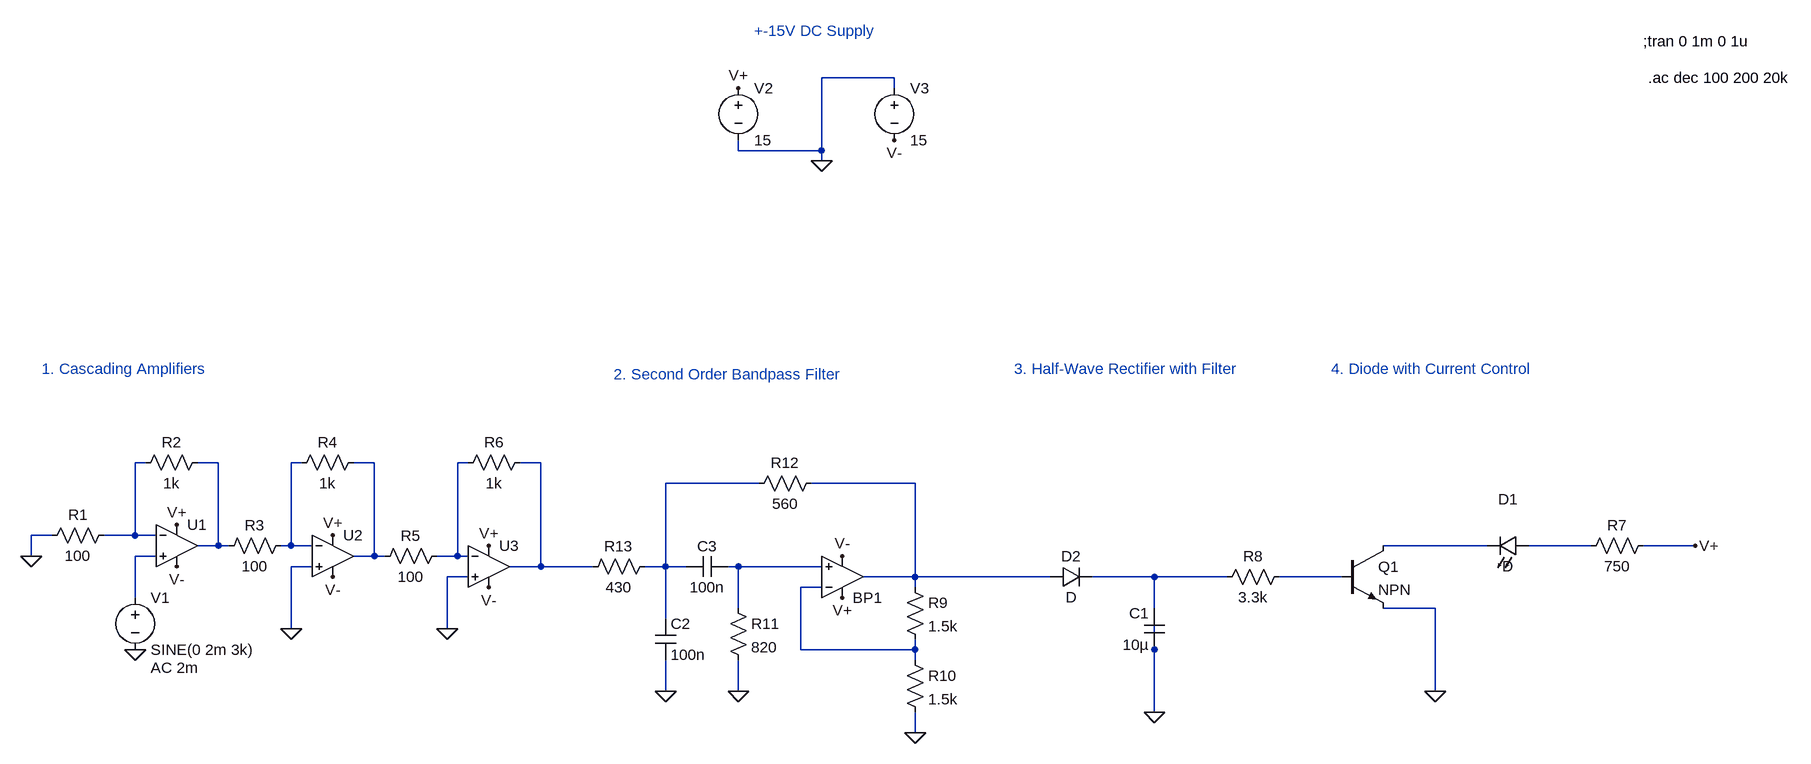
[diagram p0: schematic BP_TEST.asc]
BP_TEST.asc, the LTspice schematic file:
Version 4
SHEET 1 2900 680
WIRE 1056 -560 944 -560
WIRE 1056 -544 1056 -560
WIRE 816 -448 816 -464
WIRE 944 -448 944 -560
WIRE 944 -448 816 -448
WIRE 944 -432 944 -448
WIRE -96 32 -112 32
WIRE 16 32 -16 32
WIRE 144 32 128 32
WIRE 256 32 224 32
WIRE 400 32 384 32
WIRE 512 32 480 32
WIRE 848 64 704 64
WIRE 1088 64 928 64
WIRE -240 144 -272 144
WIRE -112 144 -112 32
WIRE -112 144 -160 144
WIRE -80 144 -112 144
WIRE 16 160 16 32
WIRE 16 160 -16 160
WIRE 32 160 16 160
WIRE 128 160 128 32
WIRE 128 160 112 160
WIRE 160 160 128 160
WIRE 1968 160 1808 160
WIRE 2128 160 2032 160
WIRE 2288 160 2208 160
WIRE -272 176 -272 144
WIRE -80 176 -112 176
WIRE 256 176 256 32
WIRE 256 176 224 176
WIRE 272 176 256 176
WIRE 384 176 384 32
WIRE 384 176 352 176
WIRE 400 176 384 176
WIRE 160 192 128 192
WIRE 512 192 512 32
WIRE 512 192 464 192
WIRE 592 192 512 192
WIRE 704 192 704 64
WIRE 704 192 672 192
WIRE 736 192 704 192
WIRE 816 192 800 192
WIRE 944 192 816 192
WIRE 400 208 368 208
WIRE 1088 208 1088 64
WIRE 1088 208 1008 208
WIRE 1296 208 1088 208
WIRE 1456 208 1360 208
WIRE 1568 208 1456 208
WIRE 1744 208 1648 208
WIRE 944 224 912 224
WIRE 1088 224 1088 208
WIRE -112 240 -112 176
WIRE 816 256 816 192
WIRE 1456 256 1456 208
WIRE 1888 256 1808 256
WIRE 704 272 704 192
WIRE 128 288 128 192
WIRE 368 288 368 208
WIRE 912 320 912 224
WIRE 1088 320 1088 304
WIRE 1088 320 912 320
WIRE 1456 320 1456 272
WIRE 1088 336 1088 320
WIRE 704 384 704 336
WIRE 816 384 816 336
WIRE 1888 384 1888 256
WIRE 1456 416 1456 320
WIRE 1088 448 1088 416
FLAG 432 160 V+
FLAG 192 144 V+
FLAG -48 128 V+
FLAG 432 224 V-
FLAG 192 208 V-
FLAG -48 192 V-
FLAG -272 176 0
FLAG 128 288 0
FLAG 368 288 0
FLAG -112 320 0
FLAG 1888 384 0
FLAG 1456 416 0
FLAG 2288 160 V+
FLAG 944 -432 0
FLAG 816 -544 V+
FLAG 1056 -464 V-
FLAG 976 240 V+
FLAG 976 176 V-
FLAG 1088 448 0
FLAG 816 384 0
FLAG 704 384 0
SYMBOL OpAmps\\UniversalOpAmp -48 160 R0
SYMATTR InstName U1
SYMBOL OpAmps\\UniversalOpAmp 192 176 R0
SYMATTR InstName U2
SYMBOL OpAmps\\UniversalOpAmp 432 192 R0
SYMATTR InstName U3
SYMBOL res -144 128 R90
WINDOW 0 0 56 VBottom 2
WINDOW 3 32 56 VTop 2
SYMATTR InstName R1
SYMATTR Value 100
SYMBOL res 0 16 R90
WINDOW 0 0 56 VBottom 2
WINDOW 3 32 56 VTop 2
SYMATTR InstName R2
SYMATTR Value 1k
SYMBOL res 128 144 R90
WINDOW 0 0 56 VBottom 2
WINDOW 3 32 56 VTop 2
SYMATTR InstName R3
SYMATTR Value 100
SYMBOL res 240 16 R90
WINDOW 0 0 56 VBottom 2
WINDOW 3 32 56 VTop 2
SYMATTR InstName R4
SYMATTR Value 1k
SYMBOL res 368 160 R90
WINDOW 0 0 56 VBottom 2
WINDOW 3 32 56 VTop 2
SYMATTR InstName R5
SYMATTR Value 100
SYMBOL res 496 16 R90
WINDOW 0 0 56 VBottom 2
WINDOW 3 32 56 VTop 2
SYMATTR InstName R6
SYMATTR Value 1k
SYMBOL voltage -112 224 R0
WINDOW 123 24 124 Left 2
WINDOW 39 0 0 Left 0
SYMATTR Value2 AC 2m
SYMATTR InstName V1
SYMATTR Value SINE(0 2m 3k)
SYMBOL npn 1744 160 R0
SYMATTR InstName Q1
SYMBOL LED 2032 176 M270
WINDOW 0 72 32 VTop 2
WINDOW 3 0 32 VBottom 2
SYMATTR InstName D1
SYMBOL res 2224 144 R90
WINDOW 0 0 56 VBottom 2
WINDOW 3 32 56 VTop 2
SYMATTR InstName R7
SYMATTR Value 750
SYMBOL diode 1296 224 R270
WINDOW 0 32 32 VTop 2
WINDOW 3 0 32 VBottom 2
SYMATTR InstName D2
SYMBOL cap 1472 320 R180
WINDOW 0 24 56 Left 2
WINDOW 3 24 8 Left 2
SYMATTR InstName C1
SYMATTR Value 10µ
SYMBOL res 1664 192 R90
WINDOW 0 0 56 VBottom 2
WINDOW 3 32 56 VTop 2
SYMATTR InstName R8
SYMATTR Value 3.3k
SYMBOL voltage 816 -560 R0
SYMATTR InstName V2
SYMATTR Value 15
SYMBOL voltage 1056 -560 R0
SYMATTR InstName V3
SYMATTR Value 15
SYMBOL OpAmps\\UniversalOpAmp 976 208 M180
SYMATTR InstName BP1
SYMBOL res 1072 208 R0
SYMATTR InstName R9
SYMATTR Value 1.5k
SYMBOL res 1072 320 R0
SYMATTR InstName R10
SYMATTR Value 1.5k
SYMBOL res 800 240 R0
SYMATTR InstName R11
SYMATTR Value 820
SYMBOL res 944 48 R90
WINDOW 0 0 56 VBottom 2
WINDOW 3 32 56 VTop 2
SYMATTR InstName R12
SYMATTR Value 560
SYMBOL res 688 176 R90
WINDOW 0 0 56 VBottom 2
WINDOW 3 32 56 VTop 2
SYMATTR InstName R13
SYMATTR Value 430
SYMBOL cap 688 272 R0
SYMATTR InstName C2
SYMATTR Value 100n
SYMBOL cap 800 176 R90
WINDOW 0 0 32 VBottom 2
WINDOW 3 32 32 VTop 2
SYMATTR InstName C3
SYMATTR Value 100n
TEXT -256 -112 Left 2 ;1. Cascading Amplifiers
TEXT 1240 -112 Left 2 ;3. Half-Wave Rectifier with Filter
TEXT 1728 -112 Left 2 ;4. Diode with Current Control
TEXT 2208 -616 Left 2 !;tran 0 1m 0 1u
TEXT 840 -632 Left 2 ;+-15V DC Supply
TEXT 2216 -560 Left 2 !.ac dec 100 200 20k
TEXT 624 -104 Left 2 ;2. Second Order Bandpass Filter

The netlist it stands for:
* BP_TEST.asc
XU1 N011 N001 V+ V- N002 level1 Avol=1Meg GBW=10Meg Vos=0 En=0 Enk=0 In=0 Ink=0 Rin=500Meg  ; pins In+ In- V+ V- OUT
XU2 0 N003 V+ V- N004 level1 Avol=1Meg GBW=10Meg Vos=0 En=0 Enk=0 In=0 Ink=0 Rin=500Meg  ; pins In+ In- V+ V- OUT
XU3 0 N005 V+ V- N006 level1 Avol=1Meg GBW=10Meg Vos=0 En=0 Enk=0 In=0 Ink=0 Rin=500Meg  ; pins In+ In- V+ V- OUT
R1 N001 0 100
R2 N002 N001 1k
R3 N003 N002 100
R4 N004 N003 1k
R5 N005 N004 100
R6 N006 N005 1k
V1 N011 0 SINE(0 2m 3k) AC 2m
Q1 N009 N014 0 0 NPN
D1 N010 N009 D
R7 V+ N010 750
D2 N008 N013 D
C1 0 N013 10µ
R8 N014 N013 3.3k
V2 V+ 0 15
V3 0 V- 15
XBP1 N012 N015 V+ V- N008 level1 Avol=1Meg GBW=10Meg Vos=0 En=0 Enk=0 In=0 Ink=0 Rin=500Meg  ; pins In+ In- V+ V- OUT
R9 N008 N015 1.5k
R10 N015 0 1.5k
R11 N012 0 820
R12 N008 N007 560
R13 N007 N006 430
C2 N007 0 100n
C3 N012 N007 100n
.model D D
.lib standard.dio
.model NPN NPN
.model PNP PNP
.lib standard.bjt
* 1. Cascading Amplifiers
* 3. Half-Wave Rectifier with Filter
* 4. Diode with Current Control
;tran 0 1m 0 1u
* +-15V DC Supply
.ac dec 100 200 20k
* 2. Second Order Bandpass Filter
.lib UniversalOpAmp1.lib
.backanno
.end